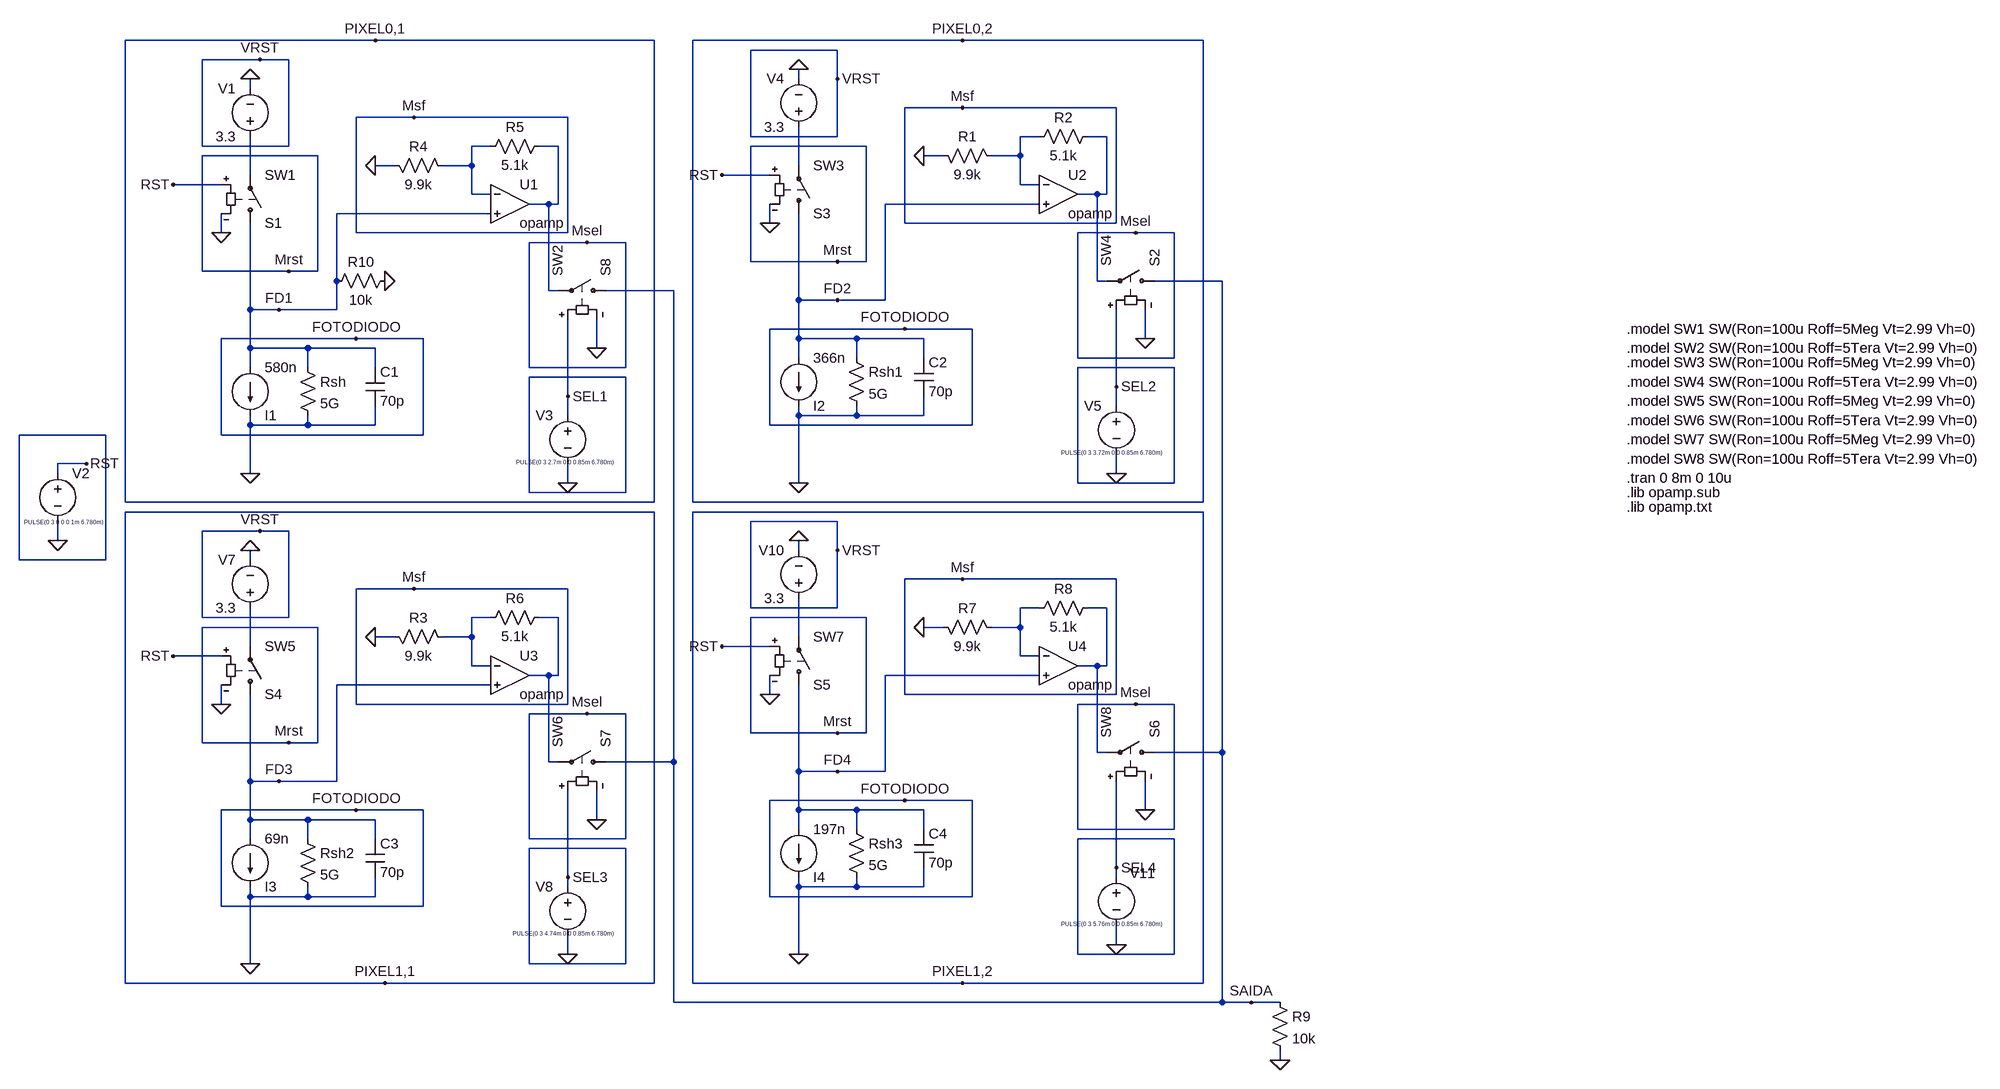
[diagram p0: schematic Draft2.asc]
Draft2.asc, the LTspice schematic file:
Version 4
SHEET 1 2612 1192
WIRE -672 -656 -1088 -656
WIRE -208 -656 -672 -656
WIRE 304 -656 -144 -656
WIRE 704 -656 304 -656
WIRE 96 -640 -48 -640
WIRE -864 -624 -960 -624
WIRE -816 -624 -864 -624
WIRE 32 -592 32 -608
WIRE 96 -592 96 -640
WIRE -880 -576 -880 -592
WIRE 304 -544 208 -544
WIRE 560 -544 304 -544
WIRE -608 -528 -704 -528
WIRE -352 -528 -608 -528
WIRE -48 -496 -48 -640
WIRE 96 -496 96 -592
WIRE 96 -496 -48 -496
WIRE 432 -496 400 -496
WIRE 544 -496 512 -496
WIRE -960 -480 -960 -624
WIRE -816 -480 -816 -624
WIRE -816 -480 -960 -480
WIRE -480 -480 -512 -480
WIRE -368 -480 -400 -480
WIRE 144 -480 -48 -480
WIRE -768 -464 -960 -464
WIRE 272 -464 240 -464
WIRE 400 -464 400 -496
WIRE 400 -464 352 -464
WIRE -640 -448 -672 -448
WIRE -512 -448 -512 -480
WIRE -512 -448 -560 -448
WIRE 32 -448 32 -512
WIRE -880 -432 -880 -496
WIRE -16 -432 -96 -432
WIRE -928 -416 -1008 -416
WIRE 400 -416 400 -464
WIRE 432 -416 400 -416
WIRE -512 -400 -512 -448
WIRE -480 -400 -512 -400
WIRE 528 -400 496 -400
WIRE 544 -400 544 -496
WIRE 544 -400 528 -400
WIRE -384 -384 -416 -384
WIRE -368 -384 -368 -480
WIRE -368 -384 -384 -384
WIRE 432 -384 176 -384
WIRE -480 -368 -736 -368
WIRE -16 -352 -16 -384
WIRE 208 -352 208 -544
WIRE 560 -352 560 -544
WIRE 560 -352 208 -352
WIRE -928 -336 -928 -368
WIRE -704 -336 -704 -528
WIRE -352 -336 -352 -528
WIRE -352 -336 -704 -336
WIRE 592 -336 496 -336
WIRE 656 -336 592 -336
WIRE -320 -320 -416 -320
WIRE -256 -320 -320 -320
WIRE -48 -288 -48 -480
WIRE 96 -288 -48 -288
WIRE 144 -288 144 -480
WIRE 144 -288 96 -288
WIRE -960 -272 -960 -464
WIRE -816 -272 -960 -272
WIRE -768 -272 -768 -464
WIRE -768 -272 -816 -272
WIRE -736 -256 -736 -368
WIRE 528 -256 528 -400
WIRE 544 -256 528 -256
WIRE 736 -256 624 -256
WIRE -384 -240 -384 -384
WIRE -368 -240 -384 -240
WIRE -176 -240 -288 -240
WIRE 32 -224 32 -368
WIRE 96 -224 32 -224
WIRE 176 -224 176 -384
WIRE 176 -224 96 -224
WIRE -880 -208 -880 -352
WIRE -832 -208 -880 -208
WIRE -736 -208 -736 -256
WIRE -736 -208 -832 -208
WIRE 208 -176 -16 -176
WIRE 320 -176 208 -176
WIRE -704 -160 -928 -160
WIRE -592 -160 -704 -160
WIRE 32 -160 32 -224
WIRE 128 -160 32 -160
WIRE 240 -160 128 -160
WIRE 608 -160 608 -208
WIRE -880 -144 -880 -208
WIRE -784 -144 -880 -144
WIRE -672 -144 -784 -144
WIRE -304 -144 -304 -192
WIRE 32 -128 32 -160
WIRE 128 -128 128 -160
WIRE 240 -128 240 -160
WIRE 496 -128 496 -336
WIRE 656 -128 656 -336
WIRE 656 -128 496 -128
WIRE -880 -112 -880 -144
WIRE -784 -112 -784 -144
WIRE -672 -112 -672 -144
WIRE -416 -112 -416 -320
WIRE -256 -112 -256 -320
WIRE -256 -112 -416 -112
WIRE 656 -112 496 -112
WIRE -256 -96 -416 -96
WIRE 560 -80 560 -208
WIRE -352 -64 -352 -192
WIRE 560 -48 560 -80
WIRE -352 -32 -352 -64
WIRE 32 -32 32 -48
WIRE 128 -32 128 -48
WIRE 128 -32 32 -32
WIRE 240 -32 240 -64
WIRE 240 -32 128 -32
WIRE -880 -16 -880 -32
WIRE -784 -16 -784 -32
WIRE -784 -16 -880 -16
WIRE -672 -16 -672 -48
WIRE -672 -16 -784 -16
WIRE -16 -16 -16 -176
WIRE 320 -16 320 -176
WIRE 320 -16 -16 -16
WIRE -1120 0 -1264 0
WIRE -928 0 -928 -160
WIRE -592 0 -592 -160
WIRE -592 0 -928 0
WIRE -1152 48 -1200 48
WIRE -1200 64 -1200 48
WIRE -880 64 -880 -16
WIRE 560 64 560 32
WIRE -352 80 -352 48
WIRE 32 80 32 -32
WIRE 496 80 496 -112
WIRE 656 80 656 -112
WIRE 656 80 496 80
WIRE -416 96 -416 -96
WIRE -256 96 -256 -96
WIRE -256 96 -416 96
WIRE -1088 112 -1088 -656
WIRE -208 112 -208 -656
WIRE -208 112 -1088 112
WIRE -144 112 -144 -656
WIRE 704 112 704 -656
WIRE 704 112 -144 112
WIRE -208 128 -1088 128
WIRE 704 128 -144 128
WIRE 96 144 -48 144
WIRE -864 160 -960 160
WIRE -816 160 -864 160
WIRE -1200 176 -1200 144
WIRE 32 192 32 176
WIRE 96 192 96 144
WIRE -1264 208 -1264 0
WIRE -1120 208 -1120 0
WIRE -1120 208 -1264 208
WIRE -880 208 -880 192
WIRE 304 240 208 240
WIRE 560 240 304 240
WIRE -608 256 -704 256
WIRE -352 256 -608 256
WIRE -48 288 -48 144
WIRE 96 288 96 192
WIRE 96 288 -48 288
WIRE 432 288 400 288
WIRE 544 288 512 288
WIRE -960 304 -960 160
WIRE -816 304 -816 160
WIRE -816 304 -960 304
WIRE -480 304 -512 304
WIRE -368 304 -400 304
WIRE 144 304 -48 304
WIRE -768 320 -960 320
WIRE 272 320 240 320
WIRE 400 320 400 288
WIRE 400 320 352 320
WIRE -640 336 -672 336
WIRE -512 336 -512 304
WIRE -512 336 -560 336
WIRE 32 336 32 272
WIRE -880 352 -880 288
WIRE -16 352 -96 352
WIRE -928 368 -1008 368
WIRE 400 368 400 320
WIRE 432 368 400 368
WIRE -512 384 -512 336
WIRE -480 384 -512 384
WIRE 528 384 496 384
WIRE 544 384 544 288
WIRE 544 384 528 384
WIRE -384 400 -416 400
WIRE -368 400 -368 304
WIRE -368 400 -384 400
WIRE 432 400 176 400
WIRE -480 416 -736 416
WIRE -16 432 -16 400
WIRE 208 432 208 240
WIRE 560 432 560 240
WIRE 560 432 208 432
WIRE -928 448 -928 416
WIRE -704 448 -704 256
WIRE -352 448 -352 256
WIRE -352 448 -704 448
WIRE 592 448 496 448
WIRE 656 448 592 448
WIRE -320 464 -416 464
WIRE -256 464 -320 464
WIRE -48 496 -48 304
WIRE 96 496 -48 496
WIRE 144 496 144 304
WIRE 144 496 96 496
WIRE -960 512 -960 320
WIRE -816 512 -960 512
WIRE -768 512 -768 320
WIRE -768 512 -816 512
WIRE 528 528 528 384
WIRE 544 528 528 528
WIRE 736 528 736 -256
WIRE 736 528 624 528
WIRE -384 544 -384 400
WIRE -368 544 -384 544
WIRE -176 544 -176 -240
WIRE -176 544 -288 544
WIRE 32 560 32 416
WIRE 96 560 32 560
WIRE 176 560 176 400
WIRE 176 560 96 560
WIRE -880 576 -880 432
WIRE -832 576 -880 576
WIRE -736 576 -736 416
WIRE -736 576 -832 576
WIRE 208 608 -16 608
WIRE 320 608 208 608
WIRE -704 624 -928 624
WIRE -592 624 -704 624
WIRE 32 624 32 560
WIRE 128 624 32 624
WIRE 240 624 128 624
WIRE 608 624 608 576
WIRE -880 640 -880 576
WIRE -784 640 -880 640
WIRE -672 640 -784 640
WIRE -304 640 -304 592
WIRE 32 656 32 624
WIRE 128 656 128 624
WIRE 240 656 240 624
WIRE 496 656 496 448
WIRE 656 656 656 448
WIRE 656 656 496 656
WIRE -880 672 -880 640
WIRE -784 672 -784 640
WIRE -672 672 -672 640
WIRE -416 672 -416 464
WIRE -256 672 -256 464
WIRE -256 672 -416 672
WIRE 656 672 496 672
WIRE -256 688 -416 688
WIRE 560 720 560 576
WIRE -352 736 -352 592
WIRE 560 736 560 720
WIRE -352 752 -352 736
WIRE 32 752 32 736
WIRE 128 752 128 736
WIRE 128 752 32 752
WIRE 240 752 240 720
WIRE 240 752 128 752
WIRE -880 768 -880 752
WIRE -784 768 -784 752
WIRE -784 768 -880 768
WIRE -672 768 -672 736
WIRE -672 768 -784 768
WIRE -16 768 -16 608
WIRE 320 768 320 608
WIRE 320 768 -16 768
WIRE -928 784 -928 624
WIRE -592 784 -592 624
WIRE -592 784 -928 784
WIRE 560 848 560 816
WIRE -352 864 -352 832
WIRE 32 864 32 752
WIRE 496 864 496 672
WIRE 656 864 656 672
WIRE 656 864 496 864
WIRE -880 880 -880 768
WIRE -416 880 -416 688
WIRE -256 880 -256 688
WIRE -256 880 -416 880
WIRE -1088 912 -1088 128
WIRE -656 912 -1088 912
WIRE -208 912 -208 128
WIRE -208 912 -656 912
WIRE -144 912 -144 128
WIRE 304 912 -144 912
WIRE 704 912 704 128
WIRE 704 912 304 912
WIRE -176 944 -176 544
WIRE 736 944 736 528
WIRE 736 944 -176 944
WIRE 784 944 736 944
WIRE 832 944 784 944
WIRE 832 1040 832 1024
FLAG -928 -336 0
FLAG -1200 176 0
FLAG -816 -272 Mrst
FLAG -1152 48 RST
FLAG -880 -592 0
FLAG -864 -624 VRST
FLAG -704 -160 FOTODIODO
FLAG -304 -144 0
FLAG -352 80 0
FLAG -320 -320 Msel
FLAG -672 -448 0
FLAG -608 -528 Msf
FLAG -16 -352 0
FLAG 32 80 0
FLAG 96 -288 Mrst
FLAG 32 -608 0
FLAG 96 -592 VRST
FLAG 208 -176 FOTODIODO
FLAG 608 -160 0
FLAG 560 64 0
FLAG 592 -336 Msel
FLAG 240 -464 0
FLAG 304 -544 Msf
FLAG -928 448 0
FLAG -880 880 0
FLAG -816 512 Mrst
FLAG -880 192 0
FLAG -864 160 VRST
FLAG -704 624 FOTODIODO
FLAG -304 640 0
FLAG -352 864 0
FLAG -320 464 Msel
FLAG -672 336 0
FLAG -608 256 Msf
FLAG -16 432 0
FLAG 32 864 0
FLAG 96 496 Mrst
FLAG 32 176 0
FLAG 96 192 VRST
FLAG 208 608 FOTODIODO
FLAG 608 624 0
FLAG 560 848 0
FLAG 592 448 Msel
FLAG 240 320 0
FLAG 304 240 Msf
FLAG -1008 -416 RST
FLAG -1008 368 RST
FLAG -96 352 RST
FLAG -96 -432 RST
FLAG -880 64 0
FLAG -672 -656 PIXEL0,1
FLAG 304 -656 PIXEL0,2
FLAG -656 912 PIXEL1,1
FLAG 304 912 PIXEL1,2
FLAG -352 -64 SEL1
FLAG 560 -80 SEL2
FLAG 560 720 SEL4
FLAG -352 736 SEL3
FLAG -832 -208 FD1
FLAG 96 -224 FD2
FLAG -832 576 FD3
FLAG 96 560 FD4
FLAG 784 944 SAIDA
FLAG 832 1040 0
FLAG -656 -256 0
SYMBOL sw -880 -336 M180
SYMATTR InstName S1
SYMATTR Value SW1
SYMBOL current -880 -112 R0
WINDOW 0 24 80 Left 2
WINDOW 3 24 0 Left 2
WINDOW 123 0 0 Left 0
WINDOW 39 0 0 Left 0
SYMATTR InstName I1
SYMATTR Value 580n
SYMBOL res -800 -128 R0
SYMATTR InstName Rsh
SYMATTR Value 5G
SYMBOL cap -688 -112 R0
SYMATTR InstName C1
SYMATTR Value 70p
SYMBOL voltage -880 -480 R180
WINDOW 0 24 96 Left 2
WINDOW 3 24 16 Left 2
WINDOW 123 0 0 Left 0
WINDOW 39 0 0 Left 0
SYMATTR InstName V1
SYMATTR Value 3.3
SYMBOL voltage -352 -48 M0
WINDOW 3 -77 94 Left 0
WINDOW 123 0 0 Left 0
WINDOW 39 0 0 Left 0
SYMATTR Value PULSE(0 3 2.7m 0 0 0.85m 6.780m)
SYMATTR InstName V3
SYMBOL voltage -1200 48 R0
WINDOW 3 -56 98 Left 0
WINDOW 123 0 0 Left 0
WINDOW 39 0 0 Left 0
SYMATTR Value PULSE(0 3 0 0 0 1m 6.780m)
SYMATTR InstName V2
SYMBOL OpAmps\\opamp -448 -448 R0
SYMATTR InstName U1
SYMBOL res -656 -464 M90
WINDOW 0 0 56 VBottom 2
WINDOW 3 32 56 VTop 2
SYMATTR InstName R4
SYMATTR Value 9.9k
SYMBOL res -384 -496 R90
WINDOW 0 0 56 VBottom 2
WINDOW 3 32 56 VTop 2
SYMATTR InstName R5
SYMATTR Value 5.1k
SYMBOL sw 640 -256 M270
SYMATTR InstName S2
SYMATTR Value SW4
SYMBOL sw 32 -352 M180
SYMATTR InstName S3
SYMATTR Value SW3
SYMBOL current 32 -128 R0
WINDOW 0 24 80 Left 2
WINDOW 3 24 0 Left 2
WINDOW 123 0 0 Left 0
WINDOW 39 0 0 Left 0
SYMATTR InstName I2
SYMATTR Value 366n
SYMBOL res 112 -144 R0
SYMATTR InstName Rsh1
SYMATTR Value 5G
SYMBOL cap 224 -128 R0
SYMATTR InstName C2
SYMATTR Value 70p
SYMBOL voltage 32 -496 R180
WINDOW 0 24 96 Left 2
WINDOW 3 24 16 Left 2
WINDOW 123 0 0 Left 0
WINDOW 39 0 0 Left 0
SYMATTR InstName V4
SYMATTR Value 3.3
SYMBOL voltage 560 -64 M0
WINDOW 3 -77 94 Left 0
WINDOW 123 0 0 Left 0
WINDOW 39 0 0 Left 0
SYMATTR Value PULSE(0 3 3.72m 0 0 0.85m 6.780m)
SYMATTR InstName V5
SYMBOL OpAmps\\opamp 464 -464 R0
SYMATTR InstName U2
SYMBOL res 256 -480 M90
WINDOW 0 0 56 VBottom 2
WINDOW 3 32 56 VTop 2
SYMATTR InstName R1
SYMATTR Value 9.9k
SYMBOL res 528 -512 R90
WINDOW 0 0 56 VBottom 2
WINDOW 3 32 56 VTop 2
SYMATTR InstName R2
SYMATTR Value 5.1k
SYMBOL sw -880 448 M180
SYMATTR InstName S4
SYMATTR Value SW5
SYMBOL current -880 672 R0
WINDOW 0 24 80 Left 2
WINDOW 3 24 0 Left 2
WINDOW 123 0 0 Left 0
WINDOW 39 0 0 Left 0
SYMATTR InstName I3
SYMATTR Value 69n
SYMBOL res -800 656 R0
SYMATTR InstName Rsh2
SYMATTR Value 5G
SYMBOL cap -688 672 R0
SYMATTR InstName C3
SYMATTR Value 70p
SYMBOL voltage -880 304 R180
WINDOW 0 24 96 Left 2
WINDOW 3 24 16 Left 2
WINDOW 123 0 0 Left 0
WINDOW 39 0 0 Left 0
SYMATTR InstName V7
SYMATTR Value 3.3
SYMBOL voltage -352 736 M0
WINDOW 3 -77 94 Left 0
WINDOW 123 0 0 Left 0
WINDOW 39 0 0 Left 0
SYMATTR Value PULSE(0 3 4.74m 0 0 0.85m 6.780m)
SYMATTR InstName V8
SYMBOL OpAmps\\opamp -448 336 R0
SYMATTR InstName U3
SYMBOL res -656 320 M90
WINDOW 0 0 56 VBottom 2
WINDOW 3 32 56 VTop 2
SYMATTR InstName R3
SYMATTR Value 9.9k
SYMBOL res -384 288 R90
WINDOW 0 0 56 VBottom 2
WINDOW 3 32 56 VTop 2
SYMATTR InstName R6
SYMATTR Value 5.1k
SYMBOL sw 32 432 M180
SYMATTR InstName S5
SYMATTR Value SW7
SYMBOL current 32 656 R0
WINDOW 0 24 80 Left 2
WINDOW 3 24 0 Left 2
WINDOW 123 0 0 Left 0
WINDOW 39 0 0 Left 0
SYMATTR InstName I4
SYMATTR Value 197n
SYMBOL res 112 640 R0
SYMATTR InstName Rsh3
SYMATTR Value 5G
SYMBOL cap 224 656 R0
SYMATTR InstName C4
SYMATTR Value 70p
SYMBOL voltage 32 288 R180
WINDOW 0 24 96 Left 2
WINDOW 3 24 16 Left 2
WINDOW 123 0 0 Left 0
WINDOW 39 0 0 Left 0
SYMATTR InstName V10
SYMATTR Value 3.3
SYMBOL voltage 560 720 M0
WINDOW 3 -77 94 Left 0
WINDOW 123 0 0 Left 0
WINDOW 39 0 0 Left 0
WINDOW 0 -65 9 Left 2
SYMATTR Value PULSE(0 3 5.76m 0 0 0.85m 6.780m)
SYMATTR InstName V11
SYMBOL OpAmps\\opamp 464 320 R0
SYMATTR InstName U4
SYMBOL res 256 304 M90
WINDOW 0 0 56 VBottom 2
WINDOW 3 32 56 VTop 2
SYMATTR InstName R7
SYMATTR Value 9.9k
SYMBOL res 528 272 R90
WINDOW 0 0 56 VBottom 2
WINDOW 3 32 56 VTop 2
SYMATTR InstName R8
SYMATTR Value 5.1k
SYMBOL sw 640 528 M270
SYMATTR InstName S6
SYMATTR Value SW8
SYMBOL sw -272 544 M270
SYMATTR InstName S7
SYMATTR Value SW6
SYMBOL sw -272 -240 M270
SYMATTR InstName S8
SYMATTR Value SW2
SYMBOL res 816 928 R0
SYMATTR InstName R9
SYMATTR Value 10k
SYMBOL res -640 -272 R90
WINDOW 0 0 56 VBottom 2
WINDOW 3 32 56 VTop 2
SYMATTR InstName R10
SYMATTR Value 10k
TEXT 1408 72 Left 2 !.tran 0 8m 0 10u
TEXT 1408 -120 Left 2 !.model SW3 SW(Ron=100u Roff=5Meg Vt=2.99 Vh=0)
TEXT 1408 120 Left 2 !.lib opamp.txt
TEXT 1408 96 Left 2 !.lib opamp.sub
TEXT 1408 -88 Left 2 !.model SW4 SW(Ron=100u Roff=5Tera Vt=2.99 Vh=0)
TEXT 1408 -56 Left 2 !.model SW5 SW(Ron=100u Roff=5Meg Vt=2.99 Vh=0)
TEXT 1408 -24 Left 2 !.model SW6 SW(Ron=100u Roff=5Tera Vt=2.99 Vh=0)
TEXT 1408 8 Left 2 !.model SW7 SW(Ron=100u Roff=5Meg Vt=2.99 Vh=0)
TEXT 1408 40 Left 2 !.model SW8 SW(Ron=100u Roff=5Tera Vt=2.99 Vh=0)
TEXT 1408 -176 Left 2 !.model SW1 SW(Ron=100u Roff=5Meg Vt=2.99 Vh=0)
TEXT 1408 -144 Left 2 !.model SW2 SW(Ron=100u Roff=5Tera Vt=2.99 Vh=0)

The netlist it stands for:
* Draft2.asc
S1 FD1 N006 RST 0 SW1
I1 FD1 0 580n
Rsh FD1 0 5G
C1 FD1 0 70p
V1 N006 0 3.3
V3 SEL1 0 PULSE(0 3 2.7m 0 0 0.85m 6.780m)
V2 RST 0 PULSE(0 3 0 0 0 1m 6.780m)
XU1 N003 FD1 N004 opamp Aol=100K GBW=10Meg  ; pins invin noninvin out
R4 0 N003 9.9k
R5 N004 N003 5.1k
S2 SAIDA N002 SEL2 0 SW4
S3 FD2 N005 RST 0 SW3
I2 FD2 0 366n
Rsh1 FD2 0 5G
C2 FD2 0 70p
V4 N005 0 3.3
V5 SEL2 0 PULSE(0 3 3.72m 0 0 0.85m 6.780m)
XU2 N001 FD2 N002 opamp Aol=100K GBW=10Meg  ; pins invin noninvin out
R1 0 N001 9.9k
R2 N002 N001 5.1k
S4 FD3 N015 RST 0 SW5
I3 FD3 0 69n
Rsh2 FD3 0 5G
C3 FD3 0 70p
V7 N015 0 3.3
V8 SEL3 0 PULSE(0 3 4.74m 0 0 0.85m 6.780m)
XU3 N012 FD3 N013 opamp Aol=100K GBW=10Meg  ; pins invin noninvin out
R3 0 N012 9.9k
R6 N013 N012 5.1k
S5 FD4 N014 RST 0 SW7
I4 FD4 0 197n
Rsh3 FD4 0 5G
C4 FD4 0 70p
V10 N014 0 3.3
V11 SEL4 0 PULSE(0 3 5.76m 0 0 0.85m 6.780m)
XU4 N010 FD4 N011 opamp Aol=100K GBW=10Meg  ; pins invin noninvin out
R7 0 N010 9.9k
R8 N011 N010 5.1k
S6 SAIDA N011 SEL4 0 SW8
S7 SAIDA N013 SEL3 0 SW6
S8 SAIDA N004 SEL1 0 SW2
R9 SAIDA 0 10k
R10 0 FD1 10k
.tran 0 8m 0 10u
.model SW3 SW(Ron=100u Roff=5Meg Vt=2.99 Vh=0)
.lib opamp.txt
.lib opamp.sub
.model SW4 SW(Ron=100u Roff=5Tera Vt=2.99 Vh=0)
.model SW5 SW(Ron=100u Roff=5Meg Vt=2.99 Vh=0)
.model SW6 SW(Ron=100u Roff=5Tera Vt=2.99 Vh=0)
.model SW7 SW(Ron=100u Roff=5Meg Vt=2.99 Vh=0)
.model SW8 SW(Ron=100u Roff=5Tera Vt=2.99 Vh=0)
.model SW1 SW(Ron=100u Roff=5Meg Vt=2.99 Vh=0)
.model SW2 SW(Ron=100u Roff=5Tera Vt=2.99 Vh=0)
.backanno
.end